# Altium schematic sheet STM32.SchDoc
size A; SheetNumber: 3; SheetTotal: 10
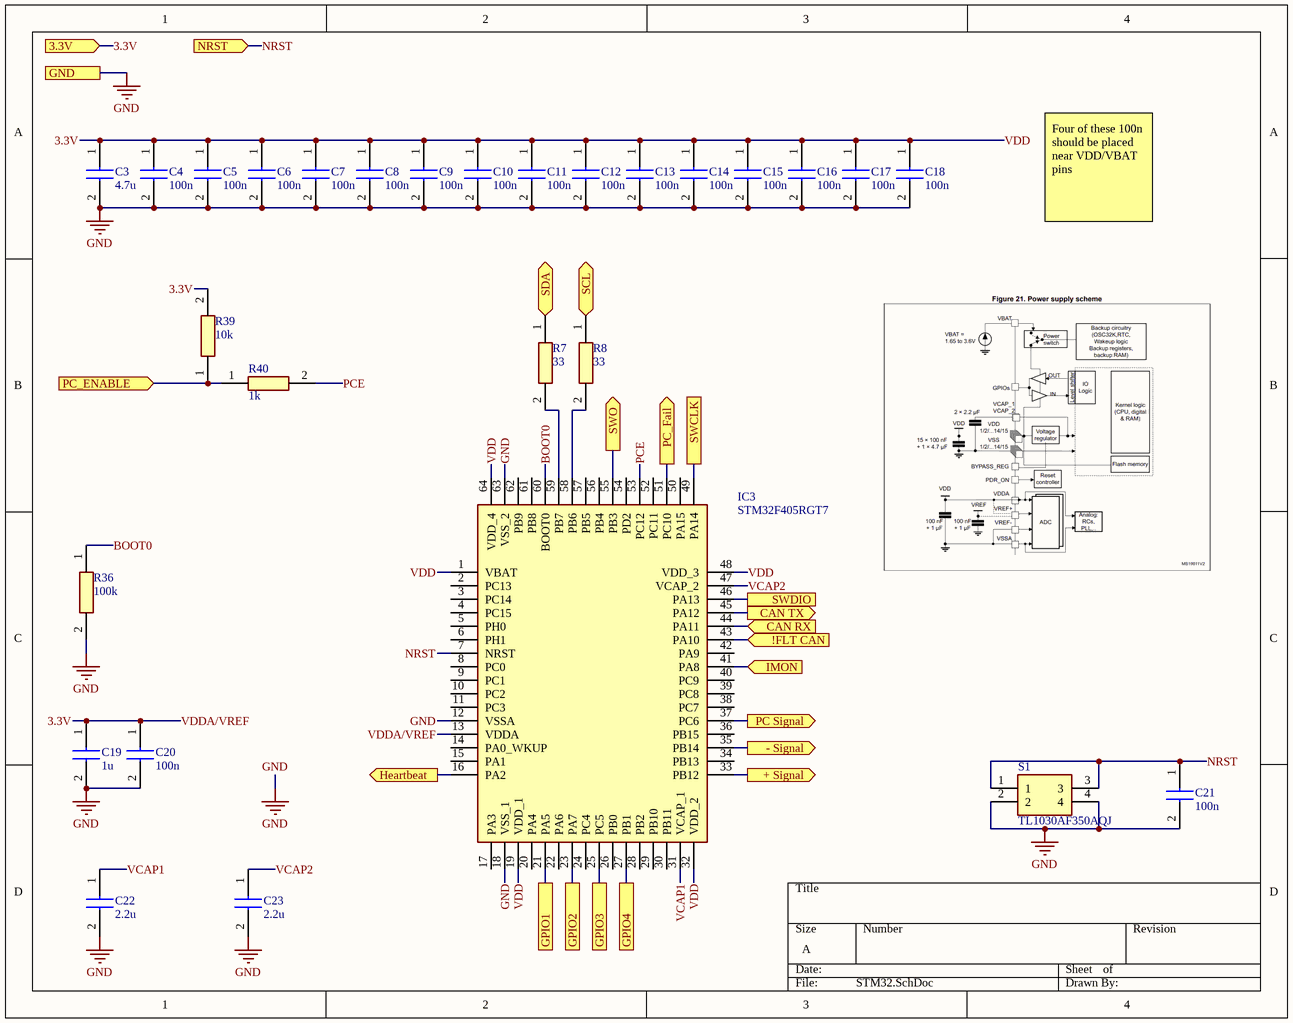
[diagram p0: STM32.SchDoc]

## Parts
C3  4.7u  [CAPC3216X180N]
C4  100n  [CAPC3216X94N]
C5  100n  [CAPC3216X94N]
C6  100n  [CAPC3216X94N]
C7  100n  [CAPC3216X94N]
C8  100n  [CAPC3216X94N]
C9  100n  [CAPC3216X94N]
C10  100n  [CAPC3216X94N]
C11  100n  [CAPC3216X94N]
C12  100n  [CAPC3216X94N]
C13  100n  [CAPC3216X94N]
C14  100n  [CAPC3216X94N]
C15  100n  [CAPC3216X94N]
C16  100n  [CAPC3216X94N]
C17  100n  [CAPC3216X94N]
C18  100n  [CAPC3216X94N]
C19  1u  [CAPC3216X180N]
C20  100n  [CAPC3216X94N]
C21  100n  [CAPC3216X94N]
C22  2.2u  [CAPC3216X180N]
C23  2.2u  [CAPC3216X180N]
IC3  STM32F405RGT7  [QFP50P1200X1200X160-64N]
R7  33  [ERJ8ENF1000V]
R8  33  [ERJ8ENF1000V]
R36  100k  [RESC3216X65N]
R39  10k  [RESC3216X65N]
R40  1k  [RESC3116X65N]
S1  TL1030AF350AQJ  [TL1030AF350AQJ]

## Ports
3.3V (in), !FLT CAN (in), + Signal (out), - Signal (out), CAN RX (in), CAN TX (out), GND, GPIO1, GPIO2, GPIO3, GPIO4, Heartbeat (out), IMON (in), NRST (in), PC Signal (out), PC_ENABLE (in), PC_Fail (out), SCL (bidir), SDA (bidir), SWCLK, SWDIO, SWO (out)

## Nets
GND: C3.2 C4.2 C5.2 C6.2 C7.2 C8.2 C9.2 C10.2 C11.2 C12.2 C13.2 C14.2 C15.2 C16.2 C17.2 C18.2 C19.2 C20.2 C21.2 C22.2 C23.2 IC3.12(VSSA) IC3.18(VSS_1) IC3.63(VSS_2) R36.2 S1.2 S1.4 ; port GND
3.3V: C3.1 C4.1 C5.1 C6.1 C7.1 C8.1 C9.1 C10.1 C11.1 C12.1 C13.1 C14.1 C15.1 C16.1 C17.1 C18.1 C19.1 C20.1 IC3.1(VBAT) IC3.13(VDDA) IC3.19(VDD_1) IC3.32(VDD_2) IC3.48(VDD_3) IC3.64(VDD_4) R39.2 ; port 3.3V  [also labelled VDD, VDDA/VREF]
!FLT CAN: IC3.43(PA10) ; port !FLT CAN
+ Signal: IC3.33(PB12) ; port + Signal
- Signal: IC3.35(PB14) ; port - Signal
BOOT0: IC3.60(BOOT0) R36.1
CAN RX: IC3.44(PA11) ; port CAN RX
CAN TX: IC3.45(PA12) ; port CAN TX
GPIO1: IC3.21(PA5) ; port GPIO1
GPIO2: IC3.23(PA7) ; port GPIO2
GPIO3: IC3.25(PC5) ; port GPIO3
GPIO4: IC3.27(PB1) ; port GPIO4
Heartbeat: IC3.16(PA2) ; port Heartbeat
IMON: IC3.41(PA8) ; port IMON
NRST: C21.1 IC3.7(NRST) S1.1 S1.3 ; port NRST
PC Signal: IC3.37(PC6) ; port PC Signal
PC_ENABLE: R39.1 R40.1 ; port PC_ENABLE
PC_Fail: IC3.51(PC10) ; port PC_Fail
PCE: IC3.53(PC12) R40.2
SCL: R8.1 ; port SCL
SDA: R7.1 ; port SDA
SWCLK: IC3.49(PA14) ; port SWCLK
SWDIO: IC3.46(PA13) ; port SWDIO
SWO: IC3.55(PB3) ; port SWO
VCAP1: C22.1 IC3.31(VCAP_1)
VCAP2: C23.1 IC3.47(VCAP_2)
NetIC3_58: IC3.58(PB6) R8.2
NetIC3_59: IC3.59(PB7) R7.2

Not connected (* = marked no-connect by the designer): IC3 2(PC13) 3(PC14) 4(PC15) 5(PH0) 6(PH1) 8(PC0) 9(PC1) 10(PC2) 11(PC3) 14(PA0_WKUP) 15(PA1) 17(PA3) 20(PA4) 22(PA6) 24(PC4) 26(PB0) 28(PB2) 29(PB10) 30(PB11) 34(PB13) 36(PB15) 38(PC7) 39(PC8) 40(PC9) 42(PA9) 50(PA15) 52(PC11) 54(PD2) 56(PB4) 57(PB5) 61(PB8) 62(PB9)

## Notes on the sheet
- Four of these 100n should be placed near VDD/VBAT pins

## Library data of the parts
C3 = GMK316AB7475KLHT: Capacitor; Manufacturer_Name: TAIYO YUDEN; Datasheet Link: https://ds.yuden.co.jp/TYCOMPAS/ap/specSheet?pn=MMASG31LAB7475KTNA01; Height: 1.8mm; Manufacturer_Part_Number: GMK316AB7475KLHT; Mouser Part Number: 963-GMK316AB7475KLHT; Mouser Price/Stock: https://www.mouser.co.uk/ProductDetail/TAIYO-YUDEN/GMK316AB7475KLHT?qs=CNQs48zzdnoeKLJ9%2F6WNWQ%3D%3D; Arrow Part Number: GMK316AB7475KLHT; Arrow Price/Stock: https://www.arrow.com/en/products/gmk316ab7475klht/taiyo-yuden?utm_currency=USD&region=nac
C4-C18 C20 C21 = 12065C104J4Z2A: Capacitor; Manufacturer_Name: Kyocera AVX; Datasheet Link: https://spicat.kyocera-avx.com/product/mlcc/chartview/12065C104J4Z2A/DataSheet/X7R; Height: 0.94mm; Manufacturer_Part_Number: 12065C104J4Z2A; Mouser Part Number: 581-12065C104J4Z2A; Mouser Price/Stock: https://www.mouser.com/Search/Refine.aspx?Keyword=581-12065C104J4Z2A
C19 = HMK316B7105KLHT: Capacitor; Manufacturer_Name: TAIYO YUDEN; Datasheet Link: https://mouser.componentsearchengine.com/Datasheets/1/HMK316B7105KLHT.pdf; Height: 1.8mm; Manufacturer_Part_Number: HMK316B7105KLHT; Mouser Part Number: 963-HMK316B7105KLHT; Mouser Price/Stock: https://www.mouser.co.uk/ProductDetail/TAIYO-YUDEN/HMK316B7105KLHT?qs=sz8xDBnIhcFmvpGfTAF0nQ%3D%3D; Arrow Part Number: HMK316B7105KLHT; Arrow Price/Stock: null?utm_currency=USD&region=nac
C22 C23 = CL31B225KCHSNNE: Capacitor; Manufacturer_Name: SAMSUNG; Datasheet Link: https://ms.componentsearchengine.com/Datasheets/2/CL31B225KCHSNNE.pdf; Height: 1.8mm; Manufacturer_Part_Number: CL31B225KCHSNNE; Mouser Part Number: 187-CL31B225KCHSNNE; Mouser Price/Stock: https://www.mouser.co.uk/ProductDetail/Samsung-Electro-Mechanics/CL31B225KCHSNNE?qs=EqekMjxHB%2FO4jGlN37Y2aA%3D%3D; Arrow Part Number: CL31B225KCHSNNE; Arrow Price/Stock: https://www.arrow.com/en/products/cl31b225kchsnne/samsung-electro-mechanics?utm_currency=USD&region=nac
IC3 = STM32F405RGT7: Integrated Circuit; Manufacturer_Name: STMicroelectronics; Datasheet Link: https://www.st.com/content/ccc/resource/technical/document/datasheet/ef/92/76/6d/bb/c2/4f/f7/DM00037051.pdf/files/DM00037051.pdf/jcr:content/translations/en.DM00037051.pdf; Height: 1.6mm; Manufacturer_Part_Number: STM32F405RGT7; Mouser Part Number: 511-STM32F405RGT7; Mouser Price/Stock: https://www.mouser.co.uk/ProductDetail/STMicroelectronics/STM32F405RGT7?qs=DqCdCwOw4%2F6rAq3yUvY8rA%3D%3D; Arrow Part Number: STM32F405RGT7; Arrow Price/Stock: https://www.arrow.com/en/products/stm32f405rgt7/stmicroelectronics?utm_currency=USD&region=nac
R7 R8 = ERJ-8ENF33R0V: Resistor; Manufacturer_Name: Panasonic; Datasheet Link: https://industrial.panasonic.com/cdbs/www-data/pdf/RDA0000/AOA0000C86.pdf; Height: 0.7mm; Manufacturer_Part_Number: ERJ-8ENF33R0V; Mouser Part Number: 667-ERJ-8ENF33R0V; Mouser Price/Stock: https://www.mouser.co.uk/ProductDetail/Panasonic/ERJ-8ENF33R0V?qs=8%252BG0TiN%2FgVpb1yH%2F8k6uQg%3D%3D
R36 = MCA1206ME1003BP500: Resistor; Manufacturer_Name: Vishay; Datasheet Link: https://www.vishay.com/docs/28700/mcx0x0xpre.pdf; Height: 0.65mm; Manufacturer_Part_Number: MCA1206ME1003BP500
R39 = SFR18EZPJ103: Resistor; Manufacturer_Name: ROHM Semiconductor; Datasheet Link: https://fscdn.rohm.com/en/products/databook/datasheet/passive/resistor/chip_resistor/sfr-e.pdf; Height: 0.65mm; Manufacturer_Part_Number: SFR18EZPJ103
R40 = CRGS1206J1K0: Resistor; Manufacturer_Name: TE Connectivity; Datasheet Link: https://www.te.com/commerce/DocumentDelivery/DDEController?Action=srchrtrv&DocNm=9-1773463-8&DocType=Data%20Sheet&DocLang=English&PartCntxt=3-2176245-7&DocFormat=pdf; Height: 0.65mm; Manufacturer_Part_Number: CRGS1206J1K0; Mouser Part Number: 279-CRGS1206J1K0; Mouser Price/Stock: https://www.mouser.com/Search/Refine.aspx?Keyword=279-CRGS1206J1K0
S1 = TL1030AF350AQJ: Switch; Manufacturer_Name: E-Switch; Datasheet Link: https://configured-product-images.s3.amazonaws.com/2D/specs/TL1030AF350AQJ.pdf; Height: 1.95mm; Manufacturer_Part_Number: TL1030AF350AQJ; Mouser Part Number: 612-TL1030AF350AQJ; Mouser Price/Stock: https://www.mouser.co.uk/ProductDetail/E-Switch/TL1030AF350AQJ?qs=VVKQmw408U%2FgalG8VZqjEg%3D%3D